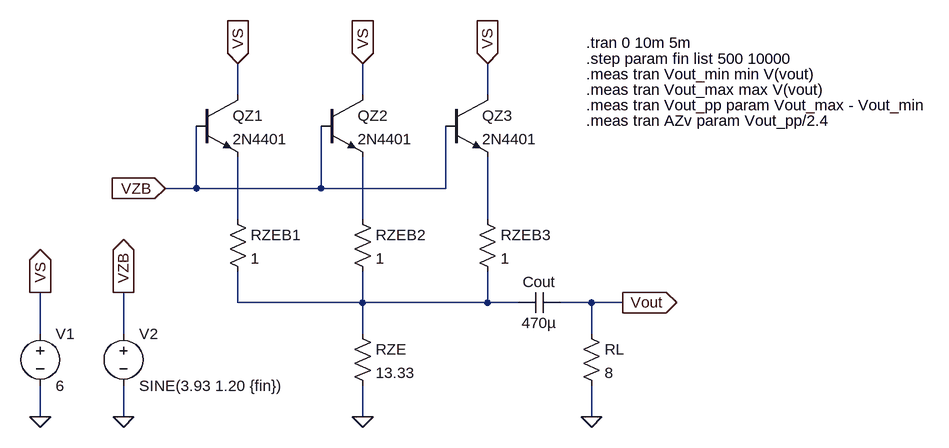
[diagram p0: schematic z.asc]
z.asc, the LTspice schematic file:
Version 4.1
SHEET 1 1212 680
WIRE 96 48 96 0
WIRE 288 48 288 0
WIRE 480 48 480 0
WIRE 32 192 32 96
WIRE 32 192 -16 192
WIRE 224 192 224 96
WIRE 224 192 32 192
WIRE 416 192 416 96
WIRE 416 192 224 192
WIRE 96 240 96 144
WIRE 288 240 288 144
WIRE 480 240 480 144
WIRE 96 368 96 320
WIRE 288 368 288 320
WIRE 288 368 96 368
WIRE 480 368 480 320
WIRE 480 368 288 368
WIRE 528 368 480 368
WIRE 640 368 592 368
WIRE 688 368 640 368
WIRE -208 416 -208 352
WIRE -80 416 -80 352
WIRE 288 416 288 368
WIRE 640 416 640 368
WIRE -208 544 -208 496
WIRE -80 544 -80 496
WIRE 288 544 288 496
WIRE 640 544 640 496
FLAG -208 544 0
FLAG -80 544 0
FLAG -208 352 VS
IOPIN -208 352 Out
FLAG -80 352 VZB
IOPIN -80 352 Out
FLAG 96 0 VS
IOPIN 96 0 In
FLAG 288 0 VS
IOPIN 288 0 In
FLAG 480 0 VS
IOPIN 480 0 In
FLAG -16 192 VZB
IOPIN -16 192 In
FLAG 288 544 0
FLAG 640 544 0
FLAG 688 368 Vout
IOPIN 688 368 Out
SYMBOL npn 32 48 R0
SYMATTR InstName QZ1
SYMATTR Value 2N4401
SYMBOL npn 224 48 R0
SYMATTR InstName QZ2
SYMATTR Value 2N4401
SYMBOL npn 416 48 R0
SYMATTR InstName QZ3
SYMATTR Value 2N4401
SYMBOL voltage -208 400 R0
SYMATTR InstName V1
SYMATTR Value 6
SYMBOL voltage -80 400 R0
WINDOW 123 0 0 Left 0
WINDOW 39 0 0 Left 0
SYMATTR InstName V2
SYMATTR Value SINE(3.93 1.20 {fin})
SYMBOL res 80 224 R0
SYMATTR InstName RZEB1
SYMATTR Value 1
SYMBOL res 272 224 R0
SYMATTR InstName RZEB2
SYMATTR Value 1
SYMBOL res 464 224 R0
SYMATTR InstName RZEB3
SYMATTR Value 1
SYMBOL res 272 400 R0
SYMATTR InstName RZE
SYMATTR Value 13.33
SYMBOL cap 592 352 R90
WINDOW 0 0 32 VBottom 2
WINDOW 3 32 32 VTop 2
SYMATTR InstName Cout
SYMATTR Value 470µ
SYMBOL res 624 400 R0
SYMATTR InstName RL
SYMATTR Value 8
TEXT 632 -32 Left 2 !.tran 0 10m 5m
TEXT 632 16 Left 2 !.meas tran Vout_min min V(vout)
TEXT 632 40 Left 2 !.meas tran Vout_max max V(vout)
TEXT 632 64 Left 2 !.meas tran Vout_pp param Vout_max - Vout_min
TEXT 632 88 Left 2 !.meas tran AZv param Vout_pp/2.4
TEXT 632 -8 Left 2 !.step param fin list 500 10000

The netlist it stands for:
* z.asc
QZ1 VS VZB N001 0 2N4401
QZ2 VS VZB N002 0 2N4401
QZ3 VS VZB N003 0 2N4401
V1 VS 0 6
V2 VZB 0 SINE(3.93 1.20 {fin})
RZEB1 N001 N004 1
RZEB2 N002 N004 1
RZEB3 N003 N004 1
RZE N004 0 13.33
Cout Vout N004 470µ
RL Vout 0 8
.model NPN NPN
.model PNP PNP
.lib standard.bjt
.tran 0 10m 5m
.meas tran Vout_min min V(vout)
.meas tran Vout_max max V(vout)
.meas tran Vout_pp param Vout_max - Vout_min
.meas tran AZv param Vout_pp/2.4
.step param fin list 500 10000
.backanno
.end